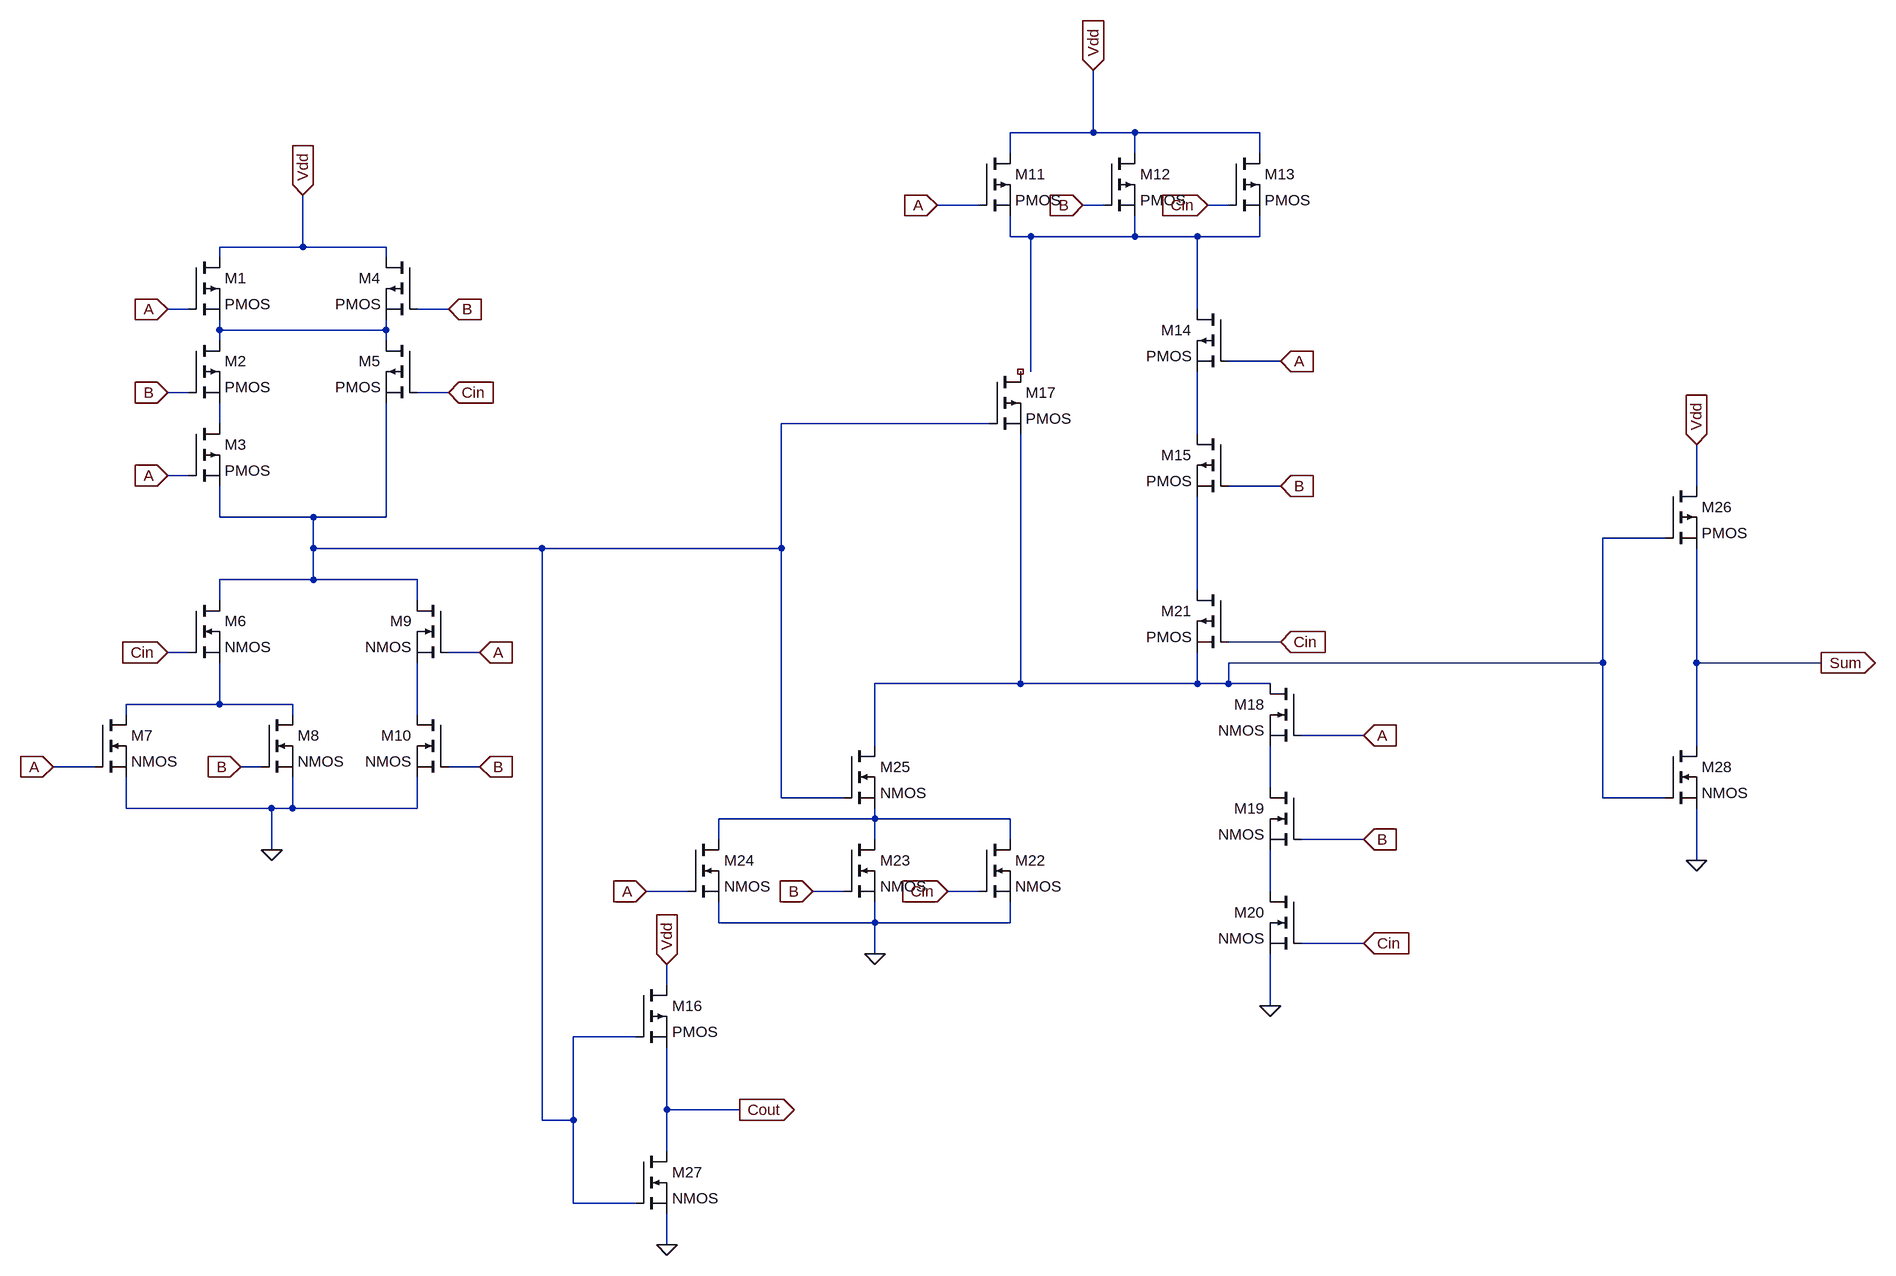
[diagram p0: schematic Adder.asc]
Adder.asc, the LTspice schematic file:
Version 4
SHEET 1 2752 1588
WIRE 1520 -144 1520 -240
WIRE 1520 -144 1392 -144
WIRE 1584 -144 1520 -144
WIRE 1776 -144 1584 -144
WIRE 1392 -112 1392 -144
WIRE 1584 -112 1584 -144
WIRE 1776 -112 1776 -144
WIRE 1344 -32 1280 -32
WIRE 1536 -32 1504 -32
WIRE 1728 -32 1696 -32
WIRE 1392 16 1392 -16
WIRE 1424 16 1392 16
WIRE 1584 16 1584 -16
WIRE 1584 16 1424 16
WIRE 1680 16 1584 16
WIRE 1776 16 1776 -16
WIRE 1776 16 1680 16
WIRE 304 32 304 -48
WIRE 304 32 176 32
WIRE 432 32 304 32
WIRE 176 48 176 32
WIRE 432 48 432 32
WIRE 128 128 96 128
WIRE 528 128 480 128
WIRE 1680 128 1680 16
WIRE 176 160 176 144
WIRE 432 160 432 144
WIRE 432 160 176 160
WIRE 176 176 176 160
WIRE 432 176 432 160
WIRE 1808 208 1728 208
WIRE 1424 224 1424 16
WIRE 128 256 96 256
WIRE 528 256 480 256
WIRE 176 304 176 272
WIRE 1360 304 1040 304
WIRE 1680 320 1680 224
WIRE 128 384 96 384
WIRE 1808 400 1728 400
WIRE 2448 400 2448 336
WIRE 176 448 176 400
WIRE 320 448 176 448
WIRE 432 448 432 272
WIRE 432 448 320 448
WIRE 2400 480 2304 480
WIRE 320 496 320 448
WIRE 672 496 320 496
WIRE 1040 496 1040 304
WIRE 1040 496 672 496
WIRE 320 544 320 496
WIRE 320 544 176 544
WIRE 480 544 320 544
WIRE 1680 560 1680 416
WIRE 176 576 176 544
WIRE 480 576 480 544
WIRE 1808 640 1728 640
WIRE 128 656 96 656
WIRE 576 656 528 656
WIRE 2304 672 2304 480
WIRE 2304 672 1728 672
WIRE 2448 672 2448 496
WIRE 2640 672 2448 672
WIRE 1408 704 1408 320
WIRE 1408 704 1184 704
WIRE 1680 704 1680 656
WIRE 1680 704 1408 704
WIRE 1728 704 1728 672
WIRE 1728 704 1680 704
WIRE 1792 704 1728 704
WIRE 176 736 176 672
WIRE 176 736 32 736
WIRE 288 736 176 736
WIRE 32 752 32 736
WIRE 288 752 288 736
WIRE 480 752 480 672
WIRE 1936 784 1840 784
WIRE 1184 800 1184 704
WIRE 2448 800 2448 672
WIRE -16 832 -80 832
WIRE 240 832 208 832
WIRE 576 832 528 832
WIRE 1792 864 1792 800
WIRE 1040 880 1040 496
WIRE 1136 880 1040 880
WIRE 2304 880 2304 672
WIRE 2400 880 2304 880
WIRE 32 896 32 848
WIRE 256 896 32 896
WIRE 288 896 288 848
WIRE 288 896 256 896
WIRE 480 896 480 848
WIRE 480 896 288 896
WIRE 1184 912 1184 896
WIRE 1184 912 944 912
WIRE 1392 912 1184 912
WIRE 944 944 944 912
WIRE 1184 944 1184 912
WIRE 1392 944 1392 912
WIRE 1936 944 1840 944
WIRE 256 960 256 896
WIRE 2448 976 2448 896
WIRE 896 1024 832 1024
WIRE 1136 1024 1088 1024
WIRE 1344 1024 1296 1024
WIRE 1792 1024 1792 960
WIRE 944 1072 944 1040
WIRE 1184 1072 1184 1040
WIRE 1184 1072 944 1072
WIRE 1392 1072 1392 1040
WIRE 1392 1072 1184 1072
WIRE 1936 1104 1840 1104
WIRE 1184 1120 1184 1072
WIRE 864 1168 864 1136
WIRE 1792 1200 1792 1120
WIRE 816 1248 720 1248
WIRE 864 1360 864 1264
WIRE 976 1360 864 1360
WIRE 672 1376 672 496
WIRE 720 1376 720 1248
WIRE 720 1376 672 1376
WIRE 864 1424 864 1360
WIRE 720 1504 720 1376
WIRE 816 1504 720 1504
WIRE 864 1568 864 1520
FLAG 256 960 0
FLAG 1792 1200 0
FLAG 1184 1120 0
FLAG 832 1024 A
IOPIN 832 1024 In
FLAG 1936 784 A
IOPIN 1936 784 In
FLAG 1808 208 A
IOPIN 1808 208 In
FLAG 1280 -32 A
IOPIN 1280 -32 In
FLAG 1088 1024 B
IOPIN 1088 1024 In
FLAG 1936 944 B
IOPIN 1936 944 In
FLAG 1808 400 B
IOPIN 1808 400 In
FLAG 1504 -32 B
IOPIN 1504 -32 In
FLAG 1696 -32 Cin
IOPIN 1696 -32 In
FLAG 1808 640 Cin
IOPIN 1808 640 In
FLAG 1936 1104 Cin
IOPIN 1936 1104 In
FLAG 1296 1024 Cin
IOPIN 1296 1024 In
FLAG 96 128 A
IOPIN 96 128 In
FLAG -80 832 A
IOPIN -80 832 In
FLAG 96 384 A
IOPIN 96 384 In
FLAG 576 656 A
IOPIN 576 656 In
FLAG 96 256 B
IOPIN 96 256 In
FLAG 528 128 B
IOPIN 528 128 In
FLAG 208 832 B
IOPIN 208 832 In
FLAG 576 832 B
IOPIN 576 832 In
FLAG 96 656 Cin
IOPIN 96 656 In
FLAG 528 256 Cin
IOPIN 528 256 In
FLAG 2448 976 0
FLAG 864 1568 0
FLAG 976 1360 Cout
IOPIN 976 1360 Out
FLAG 2640 672 Sum
IOPIN 2640 672 Out
FLAG 304 -48 Vdd
IOPIN 304 -48 In
FLAG 864 1136 Vdd
IOPIN 864 1136 In
FLAG 1520 -240 Vdd
IOPIN 1520 -240 In
FLAG 2448 336 Vdd
IOPIN 2448 336 In
SYMBOL pmos 128 48 R0
SYMATTR InstName M1
SYMBOL pmos 128 176 R0
SYMATTR InstName M2
SYMBOL pmos 128 304 R0
SYMATTR InstName M3
SYMBOL pmos 480 48 M0
SYMATTR InstName M4
SYMBOL pmos 480 176 M0
SYMATTR InstName M5
SYMBOL nmos 128 576 R0
SYMATTR InstName M6
SYMBOL nmos -16 752 R0
SYMATTR InstName M7
SYMBOL nmos 240 752 R0
SYMATTR InstName M8
SYMBOL nmos 528 576 M0
SYMATTR InstName M9
SYMBOL nmos 528 752 M0
SYMATTR InstName M10
SYMBOL pmos 1344 -112 R0
SYMATTR InstName M11
SYMBOL pmos 1536 -112 R0
SYMATTR InstName M12
SYMBOL pmos 1728 -112 R0
SYMATTR InstName M13
SYMBOL pmos 1360 224 R0
SYMATTR InstName M17
SYMBOL nmos 1840 704 M0
SYMATTR InstName M18
SYMBOL nmos 1840 864 M0
SYMATTR InstName M19
SYMBOL nmos 1840 1024 M0
SYMATTR InstName M20
SYMBOL nmos 1344 944 R0
SYMATTR InstName M22
SYMBOL nmos 1136 944 R0
SYMATTR InstName M23
SYMBOL nmos 896 944 R0
SYMATTR InstName M24
SYMBOL nmos 1136 800 R0
SYMATTR InstName M25
SYMBOL pmos 1728 560 M0
SYMATTR InstName M21
SYMBOL pmos 1728 128 M0
SYMATTR InstName M14
SYMBOL pmos 1728 320 M0
SYMATTR InstName M15
SYMBOL pmos 816 1168 R0
SYMATTR InstName M16
SYMBOL pmos 2400 400 R0
SYMATTR InstName M26
SYMBOL nmos 816 1424 R0
SYMATTR InstName M27
SYMBOL nmos 2400 800 R0
SYMATTR InstName M28

The netlist it stands for:
* Adder.asc
M1 Vdd A N002 N002 PMOS
M2 N002 B N003 N003 PMOS
M3 N003 A N004 N004 PMOS
M4 Vdd B N002 N002 PMOS
M5 N002 Cin N004 N004 PMOS
M6 N004 Cin N008 N008 NMOS
M7 N008 A 0 0 NMOS
M8 N008 B 0 0 NMOS
M9 N004 A N009 N009 NMOS
M10 N009 B 0 0 NMOS
M11 Vdd A N001 N001 PMOS
M12 Vdd B N001 N001 PMOS
M13 Vdd Cin N001 N001 PMOS
M17 NC_01 N004 N006 N006 PMOS
M18 N006 A N010 N010 NMOS
M19 N010 B N012 N012 NMOS
M20 N012 Cin 0 0 NMOS
M22 N011 Cin 0 0 NMOS
M23 N011 B 0 0 NMOS
M24 N011 A 0 0 NMOS
M25 N006 N004 N011 N011 NMOS
M21 N007 Cin N006 N006 PMOS
M14 N001 A N005 N005 PMOS
M15 N005 B N007 N007 PMOS
M16 Vdd N004 Cout Cout PMOS
M26 Vdd N006 Sum Sum PMOS
M27 Cout N004 0 0 NMOS
M28 Sum N006 0 0 NMOS
.model NMOS NMOS
.model PMOS PMOS
.lib standard.mos
.backanno
.end